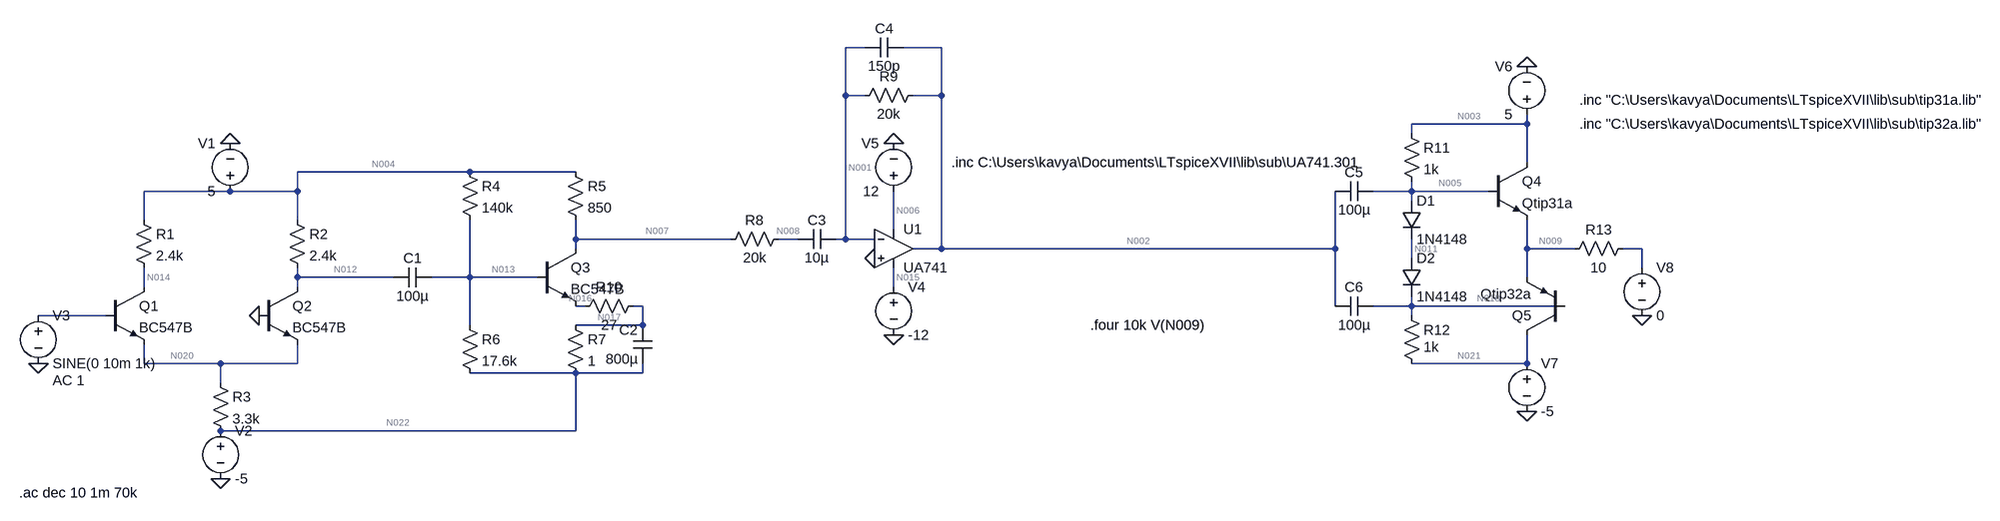
[diagram p0: schematic fullpp4.asc]
fullpp4.asc, the LTspice schematic file:
Version 4
SHEET 1 1788 680
WIRE -176 -128 -208 -128
WIRE -48 -128 -112 -128
WIRE -208 -48 -208 -128
WIRE -176 -48 -208 -48
WIRE -48 -48 -48 -128
WIRE -48 -48 -96 -48
WIRE 928 0 928 -16
WIRE 928 0 736 0
WIRE 736 16 736 0
WIRE 928 64 928 0
WIRE -848 80 -1136 80
WIRE -672 80 -848 80
WIRE -1248 112 -1392 112
WIRE -1136 112 -1136 80
WIRE -1136 112 -1248 112
WIRE 736 112 736 96
WIRE 736 112 672 112
WIRE 864 112 736 112
WIRE 736 128 736 112
WIRE -1392 160 -1392 112
WIRE -1136 160 -1136 112
WIRE -128 176 -128 112
WIRE -672 192 -672 160
WIRE -400 192 -672 192
WIRE -288 192 -320 192
WIRE -208 192 -208 -48
WIRE -208 192 -224 192
WIRE -160 192 -208 192
WIRE -672 208 -672 192
WIRE -48 208 -48 -48
WIRE -48 208 -96 208
WIRE 608 208 608 112
WIRE 608 208 -48 208
WIRE 928 208 928 160
WIRE 1008 208 928 208
WIRE 1120 208 1088 208
WIRE 736 224 736 192
WIRE 1120 240 1120 208
WIRE -1136 256 -1136 240
WIRE -976 256 -1136 256
WIRE -848 256 -848 160
WIRE -848 256 -912 256
WIRE -736 256 -848 256
WIRE 928 256 928 208
WIRE -1392 272 -1392 240
WIRE -1136 272 -1136 256
WIRE -128 272 -128 240
WIRE -656 304 -672 304
WIRE -560 304 -576 304
WIRE 608 304 608 208
WIRE 736 304 736 288
WIRE 736 304 672 304
WIRE 992 304 736 304
WIRE -1456 320 -1568 320
WIRE 736 320 736 304
WIRE -848 336 -848 256
WIRE -560 336 -560 304
WIRE -560 336 -672 336
WIRE -1392 400 -1392 368
WIRE -1264 400 -1392 400
WIRE -1136 400 -1136 368
WIRE -1136 400 -1264 400
WIRE 928 400 928 352
WIRE 928 400 736 400
WIRE -672 416 -848 416
WIRE -560 416 -560 400
WIRE -560 416 -672 416
WIRE -1264 432 -1264 400
WIRE -672 512 -672 416
WIRE -672 512 -1264 512
FLAG -1264 592 0
FLAG -1568 400 0
FLAG -1248 32 0
FLAG -128 32 0
FLAG -128 352 0
FLAG -160 224 0
FLAG 928 -96 0
FLAG 928 480 0
FLAG 1120 320 0
FLAG -1200 320 0
SYMBOL voltage -1248 128 R180
WINDOW 0 24 96 Left 2
WINDOW 3 24 16 Left 2
WINDOW 123 0 0 Left 0
WINDOW 39 0 0 Left 0
SYMATTR InstName V1
SYMATTR Value 5
SYMBOL res -1408 144 R0
SYMATTR InstName R1
SYMATTR Value 2.4k
SYMBOL res -1152 144 R0
SYMATTR InstName R2
SYMATTR Value 2.4k
SYMBOL npn -1456 272 R0
SYMATTR InstName Q1
SYMATTR Value BC547B
SYMBOL npn -1200 272 R0
SYMATTR InstName Q2
SYMATTR Value BC547B
SYMBOL res -1280 416 R0
SYMATTR InstName R3
SYMATTR Value 3.3k
SYMBOL voltage -1264 496 R0
WINDOW 123 0 0 Left 0
WINDOW 39 0 0 Left 0
SYMATTR InstName V2
SYMATTR Value -5
SYMBOL voltage -1568 304 R0
WINDOW 123 24 124 Left 2
WINDOW 39 0 0 Left 0
SYMATTR Value2 AC 1
SYMATTR InstName V3
SYMATTR Value SINE(0 10m 1k)
SYMBOL cap -912 240 R90
WINDOW 0 0 32 VBottom 2
WINDOW 3 32 32 VTop 2
SYMATTR InstName C1
SYMATTR Value 100µ
SYMBOL res -864 64 R0
SYMATTR InstName R4
SYMATTR Value 140k
SYMBOL res -688 64 R0
SYMATTR InstName R5
SYMATTR Value 850
SYMBOL res -864 320 R0
SYMATTR InstName R6
SYMATTR Value 17.6k
SYMBOL res -688 320 R0
SYMATTR InstName R7
SYMATTR Value 1
SYMBOL npn -736 208 R0
SYMATTR InstName Q3
SYMATTR Value BC547B
SYMBOL cap -544 400 R180
WINDOW 0 24 56 Left 2
WINDOW 3 24 8 Left 2
SYMATTR InstName C2
SYMATTR Value 800µ
SYMBOL OpAmps\\opamp2 -128 144 R0
SYMATTR InstName U1
SYMATTR Value UA741
SYMBOL voltage -128 256 R0
WINDOW 123 0 0 Left 0
WINDOW 39 0 0 Left 0
SYMATTR InstName V4
SYMATTR Value -12
SYMBOL voltage -128 128 R180
WINDOW 0 24 96 Left 2
WINDOW 3 24 16 Left 2
WINDOW 123 0 0 Left 0
WINDOW 39 0 0 Left 0
SYMATTR InstName V5
SYMATTR Value 12
SYMBOL res -304 176 R90
WINDOW 0 0 56 VBottom 2
WINDOW 3 32 56 VTop 2
SYMATTR InstName R8
SYMATTR Value 20k
SYMBOL cap -224 176 R90
WINDOW 0 0 32 VBottom 2
WINDOW 3 32 32 VTop 2
SYMATTR InstName C3
SYMATTR Value 10µ
SYMBOL cap -112 -144 R90
WINDOW 0 0 32 VBottom 2
WINDOW 3 32 32 VTop 2
SYMATTR InstName C4
SYMATTR Value 150p
SYMBOL res -80 -64 R90
WINDOW 0 0 56 VBottom 2
WINDOW 3 32 56 VTop 2
SYMATTR InstName R9
SYMATTR Value 20k
SYMBOL res -560 288 R90
WINDOW 0 0 56 VBottom 2
WINDOW 3 32 56 VTop 2
SYMATTR InstName R10
SYMATTR Value 27
SYMBOL npn 864 64 R0
SYMATTR InstName Q4
SYMATTR Value Qtip31a
SYMBOL res 720 0 R0
SYMATTR InstName R11
SYMATTR Value 1k
SYMBOL res 720 304 R0
WINDOW 3 36 68 Left 2
SYMATTR Value 1k
SYMATTR InstName R12
SYMBOL voltage 928 0 R180
WINDOW 0 24 96 Left 2
WINDOW 3 24 16 Left 2
WINDOW 123 0 0 Left 0
WINDOW 39 0 0 Left 0
SYMATTR InstName V6
SYMATTR Value 5
SYMBOL res 1104 192 R90
WINDOW 0 0 56 VBottom 2
WINDOW 3 32 56 VTop 2
SYMATTR InstName R13
SYMATTR Value 10
SYMBOL voltage 928 384 R0
WINDOW 123 0 0 Left 0
WINDOW 39 0 0 Left 0
SYMATTR InstName V7
SYMATTR Value -5
SYMBOL voltage 1120 224 R0
WINDOW 123 0 0 Left 0
WINDOW 39 0 0 Left 0
SYMATTR InstName V8
SYMATTR Value 0
SYMBOL diode 720 128 R0
SYMATTR InstName D1
SYMATTR Value 1N4148
SYMBOL diode 720 224 R0
SYMATTR InstName D2
SYMATTR Value 1N4148
SYMBOL pnp 992 352 R180
SYMATTR InstName Q5
SYMATTR Value Qtip32a
SYMBOL cap 672 96 R90
WINDOW 0 0 32 VBottom 2
WINDOW 3 32 32 VTop 2
SYMATTR InstName C5
SYMATTR Value 100µ
SYMBOL cap 672 288 R90
WINDOW 0 0 32 VBottom 2
WINDOW 3 32 32 VTop 2
SYMATTR InstName C6
SYMATTR Value 100µ
TEXT -1600 616 Left 2 !.ac dec 10 1m 70k
TEXT -32 64 Left 2 !.inc C:\\Users\\kavya\\Documents\\LTspiceXVII\\lib\\sub\\UA741.301
TEXT 1016 -40 Left 2 !.inc "C:\\Users\\kavya\\Documents\\LTspiceXVII\\lib\\sub\\tip31a.lib"
TEXT 1016 0 Left 2 !.inc "C:\\Users\\kavya\\Documents\\LTspiceXVII\\lib\\sub\\tip32a.lib"
TEXT 200 336 Left 2 !.four 10k V(N009)

The netlist it stands for:
* fullpp4.asc
V1 N004 0 5
R1 N004 N014 2.4k
R2 N004 N012 2.4k
Q1 N014 N019 N020 0 BC547B
Q2 N012 0 N020 0 BC547B
R3 N020 N022 3.3k
V2 N022 0 -5
V3 N019 0 SINE(0 10m 1k) AC 1
C1 N013 N012 100µ
R4 N004 N013 140k
R5 N004 N007 850
R6 N013 N022 17.6k
R7 N017 N022 1
Q3 N007 N013 N016 0 BC547B
C2 N022 N017 800µ
XU1 0 N001 N006 N015 N002 UA741  ; pins In+ In- V+ V- OUT
V4 N015 0 -12
V5 N006 0 12
R8 N008 N007 20k
C3 N001 N008 10µ
C4 N002 N001 150p
R9 N002 N001 20k
R10 N017 N016 27
Q4 N003 N005 N009 0 Qtip31a
R11 N003 N005 1k
R12 N018 N021 1k
V6 N003 0 5
R13 N010 N009 10
V7 N021 0 -5
V8 N010 0 0
D1 N005 N011 1N4148
D2 N011 N018 1N4148
Q5 N021 N018 N009 0 Qtip32a
C5 N005 N002 100µ
C6 N018 N002 100µ
.model D D
.lib standard.dio
.model NPN NPN
.model PNP PNP
.lib standard.bjt
.ac dec 10 1m 70k
.inc C:\Users\kavya\Documents\LTspiceXVII\lib\sub\UA741.301
.inc "C:\Users\kavya\Documents\LTspiceXVII\lib\sub\tip31a.lib"
.inc "C:\Users\kavya\Documents\LTspiceXVII\lib\sub\tip32a.lib"
.four 10k V(N009)
.backanno
.end

* Results of the author's LTspice run, read from the files saved beside the schematic
* Operating Point, zero values left out:
*   V(n004) = 5 V
*   V(n014) = 3.415 V
*   V(n012) = 3.415 V
*   V(n020) = -626.5 mV
*   V(n022) = -5 V
*   V(n013) = -4.166 V
*   V(n007) = 456.7 mV
*   V(n017) = -4.995 V
*   V(n016) = -4.85 V
*   V(n002) = 1.606 mV
*   V(n015) = -12 V
*   V(n006) = 12 V
*   V(n001) = 11.18 µV
*   V(n008) = 456.7 mV
*   V(n003) = 5 V
*   V(n005) = 772.8 mV
*   V(n009) = 122.7 mV
*   V(n018) = -514.1 mV
*   V(n021) = -5 V
*   V(n011) = 129.4 mV
*   Ic(Q5) = -159.7 mA
*   Ib(Q5) = -947.5 µA
*   Ie(Q5) = 160.7 mA
*   Ic(Q4) = 172.3 mA
*   Ib(Q4) = 688.8 µA
*   Ie(Q4) = -173 mA
*   Ic(Q3) = 5.345 mA
*   Ib(Q3) = 18.1 µA
*   Ie(Q3) = -5.363 mA
*   Ic(Q2) = 660.4 µA
*   Ib(Q2) = 2.213 µA
*   Ie(Q2) = -662.7 µA
*   Ic(Q1) = 660.4 µA
*   Ib(Q1) = 2.213 µA
*   Ie(Q1) = -662.7 µA
*   I(D2) = 3.538 mA
*   I(D1) = 3.538 mA
*   I(R13) = -12.27 mA
*   I(R12) = 4.486 mA
*   I(R11) = 4.227 mA
*   I(R10) = -5.363 mA
*   I(R9) = 79.76 nA
*   I(R7) = 5.363 mA
*   I(R6) = 47.38 µA
*   I(R5) = 5.345 mA
*   I(R4) = 65.47 µA
*   I(R3) = 1.325 mA
*   I(R2) = 660.4 µA
*   I(R1) = 660.4 µA
*   I(V8) = 12.27 mA
*   I(V7) = 164.2 mA
*   I(V6) = -176.5 mA
*   I(V5) = -1.335 mA
*   I(V4) = 1.335 mA
*   I(V3) = -2.213 µA
*   I(V2) = 6.736 mA
*   I(V1) = -6.731 mA
*   Ix(u1:1) = 79.74 nA
*   Ix(u1:2) = 79.76 nA
*   Ix(u1:3) = 1.335 mA
*   Ix(u1:4) = -1.335 mA
*   Ix(u1:5) = -79.76 nA
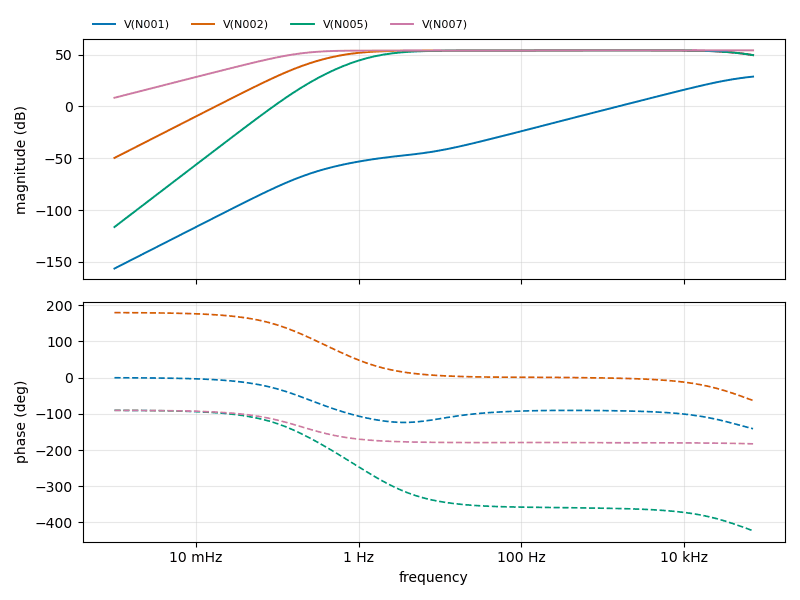
[diagram p1: AC Analysis of fullpp4.asc, plotted from the saved traces]
* AC Analysis, 1 run:
*   V(N001): -156.33 dB at 1 mHz, 28.73 dB at 70 kHz, peak 28.73 dB at 70 kHz, 3 dB below the peak at 36.57 kHz
*   V(N002): -49.69 dB at 1 mHz, 49.45 dB at 70 kHz, peak 54.04 dB at 1.585 kHz, 3 dB below the peak at 853.7 mHz and 50.71 kHz
*   V(N005): -116.28 dB at 1 mHz, 49.45 dB at 70 kHz, peak 54.04 dB at 1.585 kHz, 3 dB below the peak at 2.493 Hz and 50.71 kHz
*   V(N007): 8.33 dB at 1 mHz, 54.05 dB at 70 kHz, peak 54.05 dB at 50.12 kHz, 3 dB below the peak at 191.9 mHz